# Altium project PCB_Project.PrjPcb
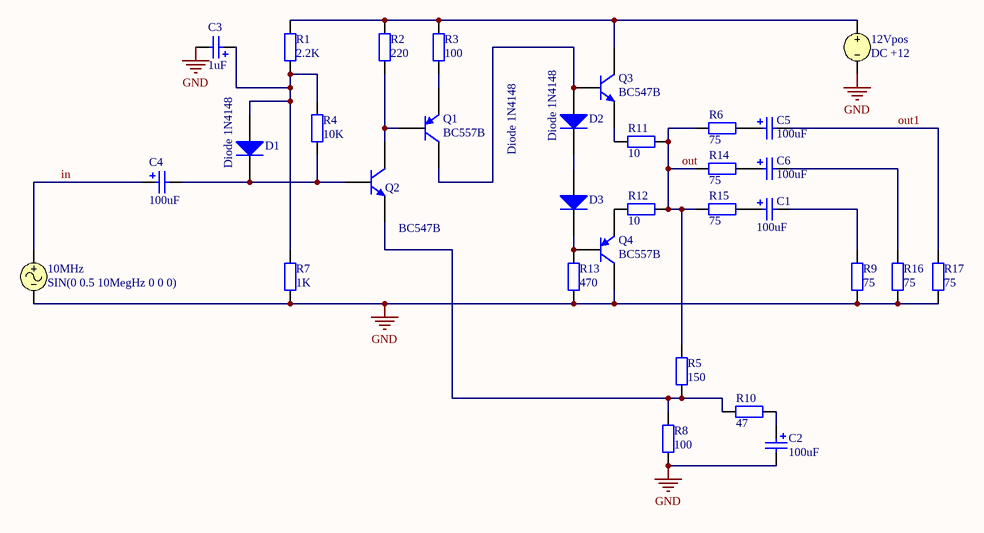
[diagram p0: Sheet1.SchDoc]
1 sheet, 32 parts. Net scope: global (net labels, ports and power ports of the same name join across sheets).

## Sheet Sheet1.SchDoc
size A4; SheetNumber: 1; SheetTotal: 1; SPICEModelCacheEDUVJKNU: <root> / <DocumentId>EDUVJKNU</DocumentId> / <CacheFrame Number="0"> / <Model Name="qbc547b" Kind="MDL"> / <Text>* / .MODEL QBC547B NPN( / +     IS=2.39E-14 / +     NF=1.008 / +     ISE=3.545E-15 / +     NE=1.541 / +     BF=294.3 / +     IKF=0.1357 / +     VAF=63.2 / +     NR=1.004 / +     ISC=6.272E-14 / +     NC=1.243 / +     BR=7.946 / +     IKR=0.1144 / +     VAR=25.9 / +     RB=1 / +     IRB=1E-06 / +     RBM=1 / +     RE=0.4683 / +     RC=0.85 / +     XTB=0 / +     EG=1.11 / +     XTI=3 / +     CJE=1.358E-11 / +     VJE=0.65 / +     MJE=0.3279 / +     TF=4.391E-10 / +     XTF=120 / +     VTF=2.643 / +     ITF=0.7495 / +     PTF=0 / +     CJC=3.728E-12 / +     VJC=0.3997 / +     MJC=0.2955 / +     XCJC=0.6193 / +     TR=1E-32 / +     CJS=0 / +     VJS=0.75 / +     MJS=0.333 / +     FC=0.9579 )</Text> / </Model> / <Model Name="qbc557b" Kind="MDL"> / <Text>* / .MODEL QBC557B PNP( / +     IS=3.834E-14 / +     NF=1.008 / +     ISE=1.219E-14 / +     NE=1.528 / +     BF=344.4 / +     IKF=0.08039 / +     VAF=21.11 / +     NR=1.005 / +     ISC=2.852E-13 / +     NC=1.28 / +     BR=14.84 / +     IKR=0.047 / +     VAR=32.02 / +     RB=1 / +     IRB=1E-06 / +     RBM=1 / +     RE=0.6202 / +     RC=0.5713 / +     XTB=0 / +     EG=1.11 / +     XTI=3 / +     CJE=1.23E-11 / +     VJE=0.6106 / +     MJE=0.378 / +     TF=5.595E-10 / +     XTF=3.414 / +     VTF=5.23 / +     ITF=0.1483 / +     PTF=0 / +     CJC=1.084E-11 / +     VJC=0.1022 / +     MJC=0.3563 / +     XCJC=0.6288 / +     TR=1E-32 / +     CJS=0 / +     VJS=0.75 / +     MJS=0.333 / +     FC=0.8027 )</Text> / </Model> / <Model Name="1n4148" Kind="MDL"> / <Text>.model 1N4148  D(Is=0.1p Rs=16 CJO=2p Tt=12n Bv=100 Ibv=0.1p)</Text> / </Model> / </CacheFrame> / </root>

### Parts
10MHz  SIN(0 0.5 10MegHz 0 0 0)
12Vpos  DC +12
C1  value 100uF  [POLAR0.8]  (hidden comment: Cap Pol2)
C2  value 100uF  [POLAR0.8]  (hidden comment: Cap Pol2)
C3  value 1uF  [POLAR0.8]  (hidden comment: Cap Pol2)
C4  value 100uF  [POLAR0.8]  (hidden comment: Cap Pol2)
C5  value 100uF  [POLAR0.8]  (hidden comment: Cap Pol2)
C6  value 100uF  [POLAR0.8]  (hidden comment: Cap Pol2)
D1  Diode 1N4148  [DO-35]
D2  Diode 1N4148  [DO-35]
D3  Diode 1N4148  [DO-35]
Q1  BC557B  [SOT54]
Q2  BC547B  [SOT54]
Q3  BC547B  [SOT54]
Q4  BC557B  [SOT54]
R1  value 2.2K  [AXIAL-0.4]  (hidden comment: Res2)
R2  value 220  [AXIAL-0.4]  (hidden comment: Res2)
R3  value 100  [AXIAL-0.4]  (hidden comment: Res2)
R4  value 10K  [AXIAL-0.4]  (hidden comment: Res2)
R5  value 150  [AXIAL-0.4]  (hidden comment: Res2)
R6  value 75  [AXIAL-0.4]  (hidden comment: Res2)
R7  value 1K  [AXIAL-0.4]  (hidden comment: Res2)
R8  value 100  [AXIAL-0.4]  (hidden comment: Res2)
R9  value 75  [AXIAL-0.4]  (hidden comment: Res2)
R10  value 47  [AXIAL-0.4]  (hidden comment: Res2)
R11  value 10  [AXIAL-0.4]  (hidden comment: Res2)
R12  value 10  [AXIAL-0.4]  (hidden comment: Res2)
R13  value 470  [AXIAL-0.4]  (hidden comment: Res2)
R14  value 75  [AXIAL-0.4]  (hidden comment: Res2)
R15  value 75  [AXIAL-0.4]  (hidden comment: Res2)
R16  value 75  [AXIAL-0.4]  (hidden comment: Res2)
R17  value 75  [AXIAL-0.4]  (hidden comment: Res2)

### Nets
GND: 10MHz.2 12Vpos.2 C2.2 C3.2 Q4.3(C) R7.1 R8.1 R9.1 R13.1 R16.1 R17.1
in: 10MHz.1 C4.1
out: R5.2 R6.2 R11.1 R12.1 R14.2 R15.2
out1: C5.2 R17.2
Net12Vpos_1: 12Vpos.1 Q3.3(C) R1.2 R2.2 R3.2
NetC1_1: C1.1 R15.1
NetC1_2: C1.2 R9.2
NetC2_1: C2.1 R10.1
NetC3_1: C3.1 D1.1(A) R1.1 R4.2 R7.2
NetC4_2: C4.2 D1.2(K) Q2.2(B) R4.1
NetC5_1: C5.1 R6.1
NetC6_1: C6.1 R14.1
NetC6_2: C6.2 R16.2
NetD2_1: D2.1(A) Q1.3(C) Q3.2(B)
NetD2_2: D2.2(K) D3.1(A)
NetD3_2: D3.2(K) Q4.2(B) R13.2
NetQ1_1: Q1.1(E) R3.1
NetQ1_2: Q1.2(B) Q2.3(C) R2.1
NetQ2_1: Q2.1(E) R5.1 R8.2 R10.2
NetQ3_1: Q3.1(E) R11.2
NetQ4_1: Q4.1(E) R12.2

### Library data of the parts
10MHz = VSIN: Sinusoidal Voltage Source; Note: PCB Footprint - Not required; Offset: 0; Amplitude: 0.5; Published: 8-Jun-2000; LatestRevisionDate: 15-Nov-2004; LatestRevisionNote: Corrected Netlist.; PackageReference: Not Applicable; Publisher: Altium Limited; Frequency: 10MegHz; Delay: 0; Damping Factor: 0; Phase: 0; DC Magnitude: 0; AC Magnitude: 0.5; AC Phase: 0
12Vpos = VSRC: Voltage Source; Note: PCB Footprint - Not required; AC Magnitude: 1; AC Phase: 0; Published: 8-Jun-2000; LatestRevisionDate: 17-Jul-2002; LatestRevisionNote: Re-released for DXP Platform.; PackageReference: Not Applicable; Publisher: Altium Limited; Value: +12
C1-C6 = Cap Pol2: Polarized Capacitor (Axial); Published: 8-Jun-2000; LatestRevisionDate: 17-Jul-2002; LatestRevisionNote: Re-released for DXP Platform.; PackageReference: POLAR0.8; Publisher: Altium Limited; PackageDescription: Polarized Capacitor; 2 Leads
D1-D3 = Diode 1N4148: High Conductance Fast Diode; Published: 8-Jun-2000; LatestRevisionDate: 17-Jul-2002; LatestRevisionNote: Re-released for DXP Platform.; DatasheetVersion: 1997; PackageReference: DO-35; Publisher: Altium Limited; PackageDescription: Diode, Axial; Body 3.8 x 1.9 mm (LxDia. max), Lead Dia. 0.53 mm (max); Code_JEDEC: DO-204-AH; ComponentLink1Description: Manufacturer Link; ComponentLink1URL: http://www.fairchildsemi.com/; ComponentLink2Description: Datasheet; ComponentLink2URL: http://www.fairchildsemi.com/ds/1N%2F1N4148.pdf
Q1 Q4 = BC557B: PNP General-purpose Transistor; Published: 17-Sep-2003; LatestRevisionDate: 12-Dec-2006; LatestRevisionNote: Footprint pad sequence fixed.; DatasheetVersion: 15-Apr-1999; PackageVersion: Feb-1997; PackageReference: SOT54; Publisher: Altium Limited; PackageDescription: Plastic Single-Ended Leaded (through hole) package; 3 Leads (TO-92); Code_JEITA: SC-43; Code_JEDEC: TO-92; ComponentLink1Description: Manufacturer Link; ComponentLink1URL: http://www.semiconductors.philips.com/; ComponentLink2Description: Datasheet; ComponentLink2URL: http://www.semiconductors.philips.com/acrobat/datasheets/BC556_557_3.pdf
Q2 Q3 = BC547B: NPN General-purpose Transistor; Published: 17-Sep-2003; LatestRevisionDate: 12-Dec-2006; LatestRevisionNote: Footprint pad sequence fixed.; DatasheetVersion: 15-Apr-1999; PackageVersion: Feb-1997; PackageReference: SOT54; Publisher: Altium Limited; PackageDescription: Plastic Single-Ended Leaded (through hole) package; 3 Leads (TO-92); Code_JEITA: SC-43; Code_JEDEC: TO-92; ComponentLink1Description: Manufacturer Link; ComponentLink1URL: http://www.semiconductors.philips.com/; ComponentLink2Description: Datasheet; ComponentLink2URL: http://www.semiconductors.philips.com/acrobat/datasheets/BC546_547_3.pdf
R1-R17 = Res2: Resistor; Published: 8-Jun-2000; LatestRevisionDate: 17-Jul-2002; LatestRevisionNote: Re-released for DXP Platform.; PackageReference: AXIAL-0.4; Publisher: Altium Limited; PackageDescription: Axial Device, Thru-Hole; 2 Leads; 0.4 in Pin Spacing